# Altium project 定位.PrjPCB
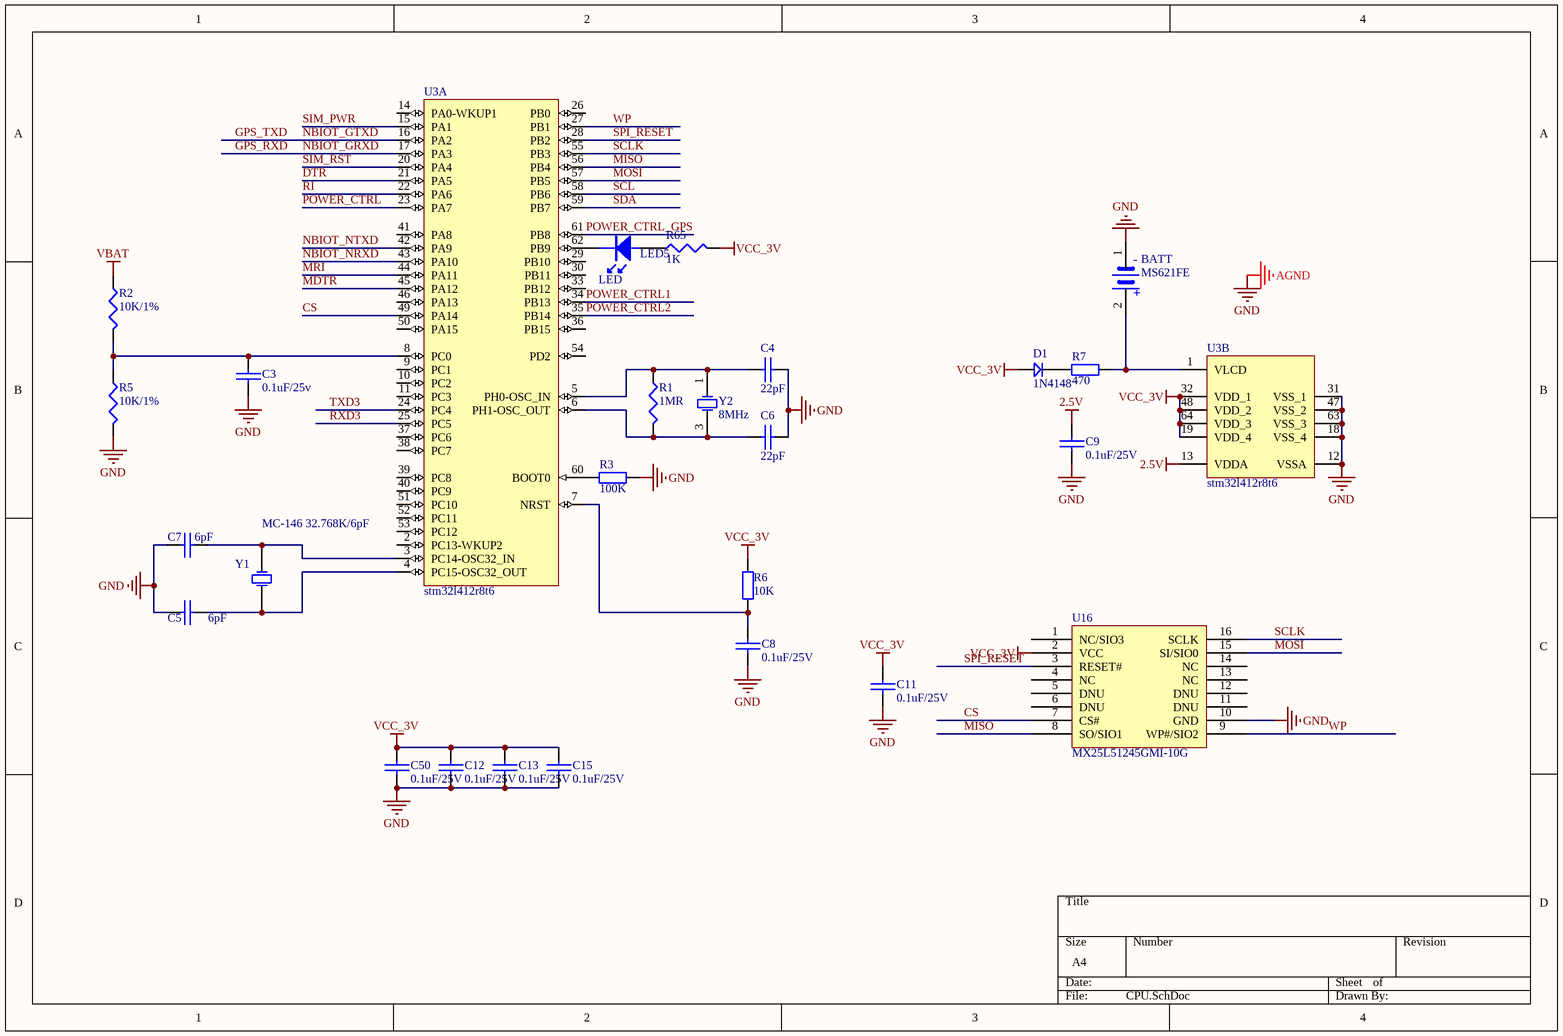
[diagram p0: CPU.SchDoc]
6 sheets, 164 parts. Net scope: global (net labels, ports and power ports of the same name join across sheets).
Board file: PCB1.PcbDoc
Sheets:
  CPU.SchDoc
  NBIOT.SchDoc
  4G.SchDoc
  sensors.SchDoc
  power.SchDoc
  GPS&&lte.SchDoc

## Sheet CPU.SchDoc
size A4

### Parts
BATT  MS621FE  [MS621FE]
C3  0.1uF/25v  [0402c]
C4  22pF  [0402c]
C5  6pF  [0402c]
C6  22pF  [0402c]
C7  6pF  [0402c]
C8  0.1uF/25V  [0402C]
C9  0.1uF/25V  [0402C]
C11  0.1uF/25V  [0402C]
C12  0.1uF/25V  [0402C]
C13  0.1uF/25V  [0402C]
C15  0.1uF/25V  [0402C]
C50  0.1uF/25V  [0402C]
D1  1N4148  [DIODE_SOP]
LED5  LED  [0603LED]
R1  1MR  [0402R]
R2  10K/1%  [0402R]
R3  100K  [0402R]
R5  10K/1%  [0402R]
R6  10K  [0402R]
R7  470  [0402R]
R65  1K  [0402R]
U3  stm32l412r8t6  [LQFP-64]  (parts A,B of 2)
U16  MX25L51245GMI-10G  [SOP127P1030X239-16N]
Y1  MC-146 32.768K/6pF  [32.768K]
Y2  8MHz  [OSCILLATOR-3.2X2.5]

### Nets
2.5V: C9.2 U3.13(VDDA)
AGND: BATT.1 C3.2 C4.1 C5.2 C6.1 C7.2 C8.1 C9.1 C11.1 C12.1 C13.1 C15.1 C50.1 R3.2 R5.2 U3.12(VSSA) U3.18(VSS_4) U3.31(VSS_1) U3.47(VSS_2) U3.63(VSS_3) U16.10(GND)  [also labelled GND]
VBAT: R2.1
VCC_3V: C11.2 C12.2 C13.2 C15.2 C50.2 D1.1 R6.1 R65.2 U3.19(VDD_4) U3.32(VDD_1) U3.48(VDD_2) U3.64(VDD_3) U16.2(VCC)  [project net VCC_3.3V_S]
CS: U3.49(PA14) U16.7(CS#)
DTR: U3.21(PA5)
GPS_RXD: U3.17(PA3)  [also labelled NBIOT_GRXD]
GPS_TXD: U3.16(PA2)  [also labelled NBIOT_GTXD]
MDTR: U3.45(PA12)
MISO: U3.56(PB4) U16.8(SO/SIO1)
MOSI: U3.57(PB5) U16.15(SI/SIO0)
MRI: U3.44(PA11)
NBIOT_NRXD: U3.43(PA10)
NBIOT_NTXD: U3.42(PA9)
POWER_CTRL: U3.23(PA7)
POWER_CTRL1: U3.34(PB13)
POWER_CTRL2: U3.35(PB14)
POWER_CTRL_GPS: U3.61(PB8)
RI: U3.22(PA6)
RXD3: U3.25(PC5)
SCL: U3.58(PB6)
SCLK: U3.55(PB3) U16.16(SCLK)
SDA: U3.59(PB7)
SIM_PWR: U3.15(PA1)
SIM_RST: U3.20(PA4)
SPI_RESET: U3.28(PB2) U16.3(RESET#)
TXD3: U3.24(PC4)
WP: U3.27(PB1) U16.9(WP#/SIO2)
NetBATT_2: BATT.2 R7.2 U3.1(VLCD)
NetC3_1: C3.1 R2.2 R5.1 U3.8(PC0)
NetC4_2: C4.2 R1.1 U3.5(PH0-OSC_IN) Y2.1(OSC1)
NetC5_1: C5.1 U3.4(PC15-OSC32_OUT) Y1.2(OSC2)
NetC6_2: C6.2 R1.2 U3.6(PH1-OSC_OUT) Y2.3(OSC2)
NetC7_1: C7.1 U3.3(PC14-OSC32_IN) Y1.1(OSC1)
NetC8_2: C8.2 R6.2 U3.7(NRST)
NetD1_2: D1.2 R7.1
NetLED5_1: LED5.1 R65.1
NetLED5_2: LED5.2 U3.62(PB9)
NetR3_1: R3.1 U3.60(BOOT0)

Not connected (* = marked no-connect by the designer): U3 2(PC13-WKUP2) 9(PC1) 10(PC2) 11(PC3) 14(PA0-WKUP1) 26(PB0) 29(PB10) 30(PB11) 33(PB12) 36(PB15) 37(PC6) 38(PC7) 39(PC8) 40(PC9) 41(PA8) 46(PA13) 50(PA15) 51(PC10) 52(PC11) 53(PC12) 54(PD2); U16 1(NC/SIO3) 4(NC) 5(DNU) 6(DNU) 11(DNU) 12(DNU) 13(NC) 14(NC)

### Notes on the sheet
- (in symbol SBatery) -; +

### Library data of the parts
BATT = SBatery
C3-C9 C11-C13 C15 C50 = CAP: Capacitor
D1 = D
R1 = Res3: Resistor; Published: 8-Jun-2000; LatestRevisionDate: 29-May-2009; LatestRevisionNote: IPC-7351 Footprint Added.; PackageReference: J1-0603; Publisher: Altium Limited; PackageDescription: Chip Resistor
R2 R5 R65 = RES1: P: 1/8W
R3 R6 R7 = Res2: Resistor; Value: 1K; Published: 8-Jun-2000; LatestRevisionDate: 17-Jul-2002; LatestRevisionNote: Re-released for DXP Platform.; PackageReference: AXIAL-0.4; Publisher: Altium Limited
U3 = STM32L100R8T6: ARM Cortex-M3 32-bit MCU, 64 KB Flash, 8 KB Internal RAM, 51 I/Os, 64-pin LQFP, -40 to 85 degC, Tray; Manufacturer: STMicroelectronics; D/A Converter: 2x12-bit (2 Channel); Data E2PROM nom (B): 2048; Display controller: LCD 4x32/8x28; FLASH Size (Prog) (kB): 64; I/Os (High Current): 51; Internal RAM Size (kB): 8; Operating Frequency(F) (Processor speed) (MHz): 32; Supply Voltage(Vcc) min (V): 1.8; DatasheetVersion: Rev. 1; PackageVersion: Rev. 4, 06/2013; PackageReference: LQFP64; PackageDescription: 64-Pin Low Profile Quad Flat Package, 10 x 10 mm Body, 0.5 mm Pitch; Core: ARM Cortex-M3; Packing: Tray; Mounting Technology: Surface Mount; PartNumber: STM32L100R8T6; ComponentLink1Description: Manufacturer URL; ComponentLink1URL: http://www.st.com/web/en/home.html; ComponentLink2Description: Datasheet; ComponentLink2URL: http://www.st.com/st-web-ui/static/active/en/resource/technical/document/datasheet/DM00078075.pdf; ComponentLink3Description: Package Specification; ComponentLink3URL: http://www.st.com/st-web-ui/static/active/en/resource/technical/document/datasheet/DM00037051.pdf
Y1 Y2 = XTAL: Crystal Oscillator; Published: 8-Jun-2000; LatestRevisionDate: 17-Jul-2002; LatestRevisionNote: Re-released for DXP Platform.; PackageReference: R38; Publisher: Altium Limited
  Y2: PackageDescription: Crystal, Thru-Hole; 2 Leads; Body 3.1 x 8.2 mm (Dia.xH)

## Sheet NBIOT.SchDoc
size A3
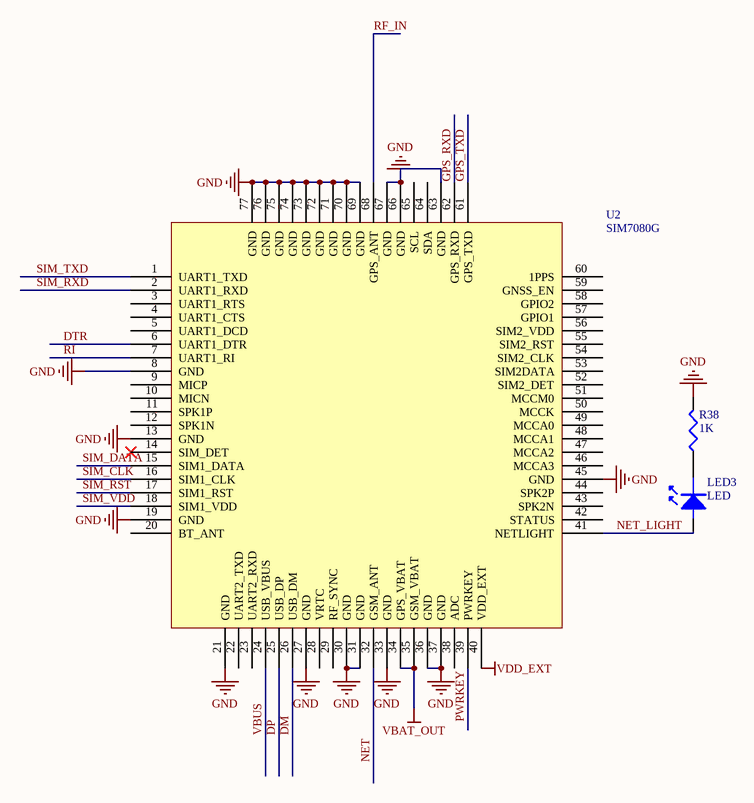
[diagram p1: NBIOT.SchDoc]

### Parts
LED3  LED  [0603LED]
R38  1K  [0402R]
U2  SIM7080G  [SIM868]

### Nets
GND: R38.2 U2.8(GND) U2.13(GND) U2.19(GND) U2.21(GND) U2.27(GND) U2.30(GND) U2.31(GND) U2.33(GND) U2.36(GND) U2.37(GND) U2.45(GND) U2.63(GND) U2.66(GND) U2.67(GND) U2.69(GND) U2.70(GND) U2.71(GND) U2.72(GND) U2.73(GND) U2.74(GND) U2.75(GND) U2.76(GND) U2.77(GND)  [project net AGND]
SIM_VDD: U2.18(SIM1_VDD)
VBAT_OUT: U2.34(GPS_VBAT) U2.35(GSM_VBAT)
VDD_EXT: U2.40(VDD_EXT)
DM: U2.26(USB_DM)
DP: U2.25(USB_DP)
DTR: U2.6(UART1_DTR)
GPS_RXD: U2.62(GPS_RXD)
GPS_TXD: U2.61(GPS_TXD)
NET: U2.32(GSM_ANT)
NET_LIGHT: LED3.1 U2.41(NETLIGHT)
PWRKEY: U2.39(PWRKEY)
RF_IN: U2.68(GPS_ANT)
RI: U2.7(UART1_RI)
SIM_CLK: U2.16(SIM1_CLK)
SIM_DATA: U2.15(SIM1_DATA)
SIM_RST: U2.17(SIM1_RST)
SIM_RXD: U2.2(UART1_RXD)
SIM_TXD: U2.1(UART1_TXD)
VBUS: U2.24(USB_VBUS)
NetLED3_2: LED3.2 R38.1

Not connected (* = marked no-connect by the designer): U2 3(UART1_RTS) 4(UART1_CTS) 5(UART1_DCD) 9(MICP) 10(MICN) 11(SPK1P) 12(SPK1N) 14(SIM_DET)* 20(BT_ANT) 22(UART2_TXD) 23(UART2_RXD) 28(VRTC) 29(RF_SYNC) 38(ADC) 42(STATUS) 43(SPK2N) 44(SPK2P) 46(MCCA3) 47(MCCA2) 48(MCCA1) 49(MCCA0) 50(MCCK) 51(MCCM0) 52(SIM2_DET) 53(SIM2DATA) 54(SIM2_CLK) 55(SIM2_RST) 56(SIM2_VDD) 57(GPIO1) 58(GPIO2) 59(GNSS_EN) 60(1PPS) 64(SDA) 65(SCL)

### Library data of the parts
R38 = RES1: P: 1/8W
U2 = SIM868E/SIM868

## Sheet 4G.SchDoc
size A2
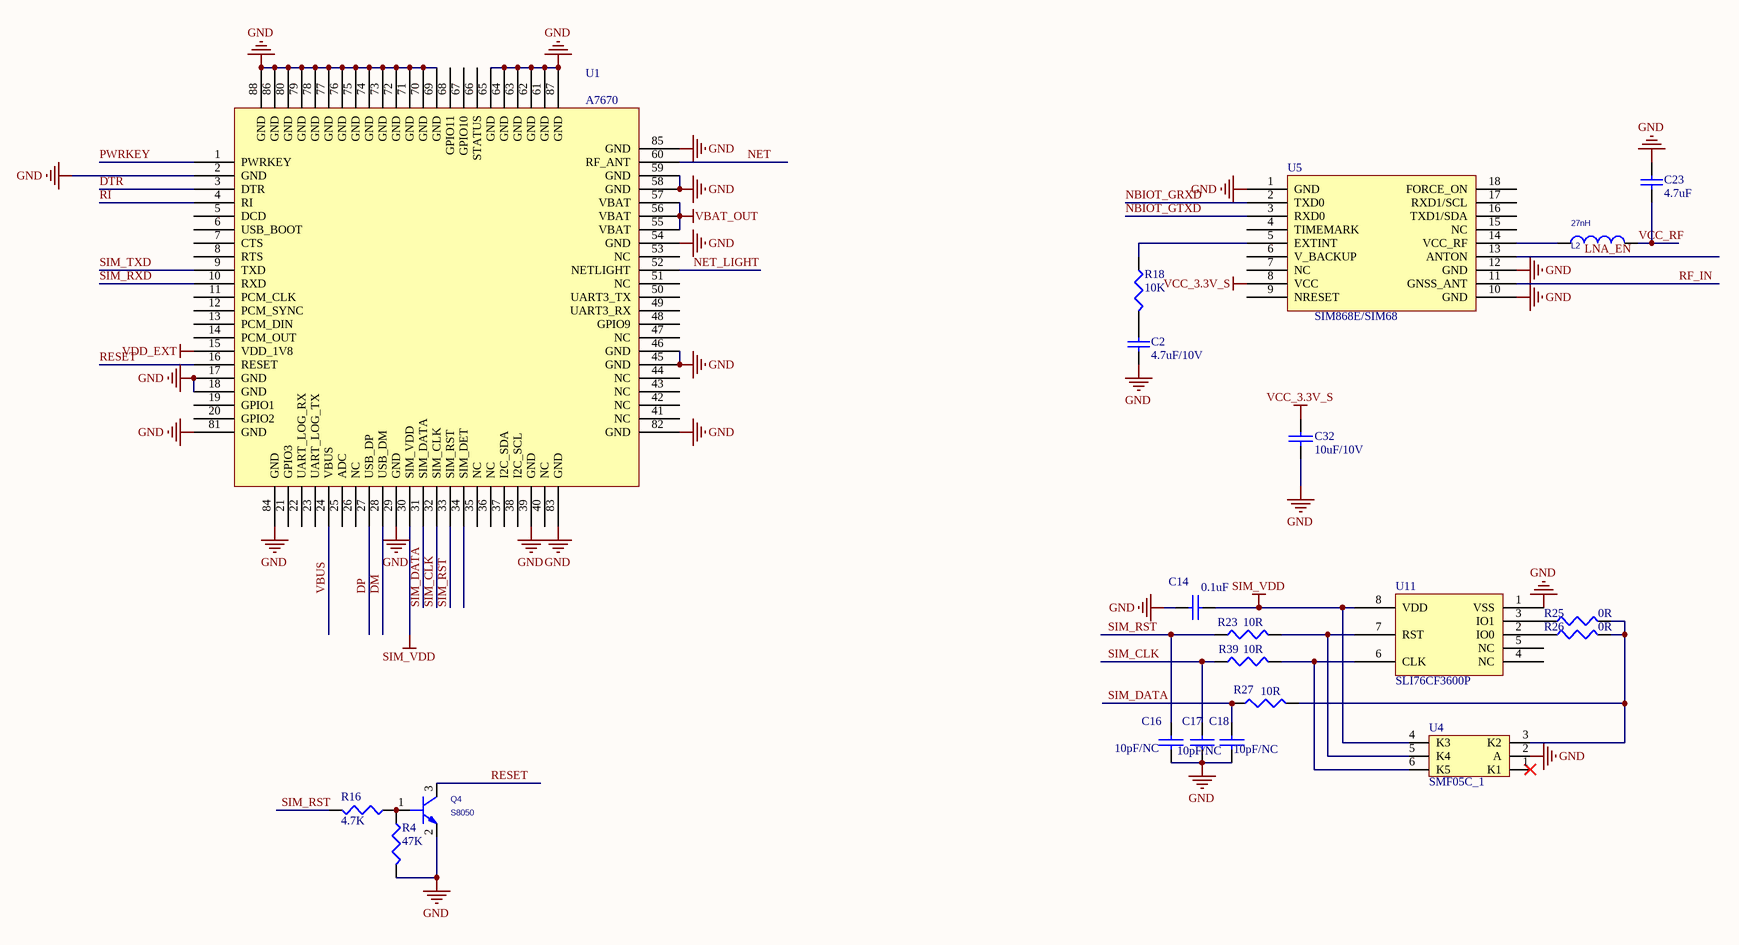
[diagram p2: 4G.SchDoc]

### Parts
C2  4.7uF/10V  [0402c]
C14  0.1uF  [0402C]
C16  10pF/NC  [0402C]
C17  10pF/NC  [0402C]
C18  10pF/NC  [0402C]
C23  4.7uF  [0402c]
C32  10uF/10V  [0402C]
L2  27nH  [0402R]
Q4  S8050  [SOT23]
R4  47K  [0402R]
R16  4.7K  [0402R]
R18  10K  [0402R]
R23  10R  [0402R]
R25  0R  [0402R]
R26  0R  [0402R]
R27  10R  [0402R]
R39  10R  [0402R]
U1  A7670  [A7670]
U4  SMF05C_1  [SC70-6L]
U5  SIM868E/SIM68  [SIM68MB]
U11  SLI76CF3600P  [QFN127P500X600X80-8N]

### Nets
GND: C2.1 C14.1 C16.1 C17.1 C18.1 C23.1 C32.1 Q4.2(E) R4.2 U1.2(GND) U1.17(GND) U1.18(GND) U1.29(GND) U1.39(GND) U1.45(GND) U1.46(GND) U1.54(GND) U1.58(GND) U1.59(GND) U1.61(GND) U1.62(GND) U1.63(GND) U1.64(GND) U1.65(GND) U1.69(GND) U1.70(GND) U1.71(GND) U1.72(GND) U1.73(GND) U1.74(GND) U1.75(GND) U1.76(GND) U1.77(GND) U1.78(GND) U1.79(GND) U1.80(GND) U1.81(GND) U1.82(GND) U1.83(GND) U1.84(GND) U1.85(GND) U1.86(GND) U1.87(GND) U1.88(GND) U4.2(A) U5.1(GND) U5.10(GND) U5.12(GND) U11.1(VSS)  [project net AGND]
SIM_VDD: C14.2 U1.30(SIM_VDD) U4.4(K3) U11.8(VDD)
VBAT_OUT: U1.55(VBAT) U1.56(VBAT) U1.57(VBAT)
VCC_3.3V_S: C32.2 U5.8(VCC)
VCC_RF: C23.2 L2.2
VDD_EXT: U1.15(VDD_1V8)
DM: U1.28(USB_DM)
DP: U1.27(USB_DP)
DTR: U1.3(DTR)
LNA_EN: U5.13(ANTON)
NBIOT_GRXD: U5.2(TXD0)  [project net GPS_RXD]
NBIOT_GTXD: U5.3(RXD0)  [project net GPS_TXD]
NET: U1.60(RF_ANT)
NET_LIGHT: U1.52(NETLIGHT)
PWRKEY: U1.1(PWRKEY)
RESET: Q4.3(C) U1.16(RESET)
RF_IN: U5.11(GNSS_ANT)
RI: U1.4(RI)
SIM_CLK: C17.2 R39.1 U1.32(SIM_CLK)
SIM_DATA: C18.2 R27.1 U1.31(SIM_DATA)
SIM_RST: C16.2 R16.2 R23.1 U1.33(SIM_RST)
SIM_RXD: U1.10(RXD)
SIM_TXD: U1.9(TXD)
VBUS: U1.24(VBUS)
NetC2_2: C2.2 R18.2
NetL2_1: L2.1 U5.14(VCC_RF)
NetQ4_1: Q4.1(B) R4.1 R16.1
NetR18_1: R18.1 U5.5(EXTINT)
NetR23_2: R23.2 U4.5(K4) U11.7(RST)
NetR25_1: R25.1 U11.3(IO1)
NetR25_2: R25.2 R26.2 R27.2 U4.3(K2)
NetR26_1: R26.1 U11.2(IO0)
NetR39_2: R39.2 U4.6(K5) U11.6(CLK)

Not connected (* = marked no-connect by the designer): U1 5(DCD) 6(USB_BOOT) 7(CTS) 8(RTS) 11(PCM_CLK) 12(PCM_SYNC) 13(PCM_DIN) 14(PCM_OUT) 19(GPIO1) 20(GPIO2) 21(GPIO3) 22(UART_LOG_RX) 23(UART_LOG_TX) 25(ADC) 26(NC) 34(SIM_DET) 35(NC) 36(NC) 37(I2C_SDA) 38(I2C_SCL) 40(NC) 41(NC) 42(NC) 43(NC) 44(NC) 47(NC) 48(GPIO9) 49(UART3_RX) 50(UART3_TX) 51(NC) 53(NC) 66(STATUS) 67(GPIO10) 68(GPIO11); U4 1(K1)*; U5 4(TIMEMARK) 6(V_BACKUP) 7(NC) 9(NRESET) 15(NC) 16(TXD1/SDA) 17(RXD1/SCL) 18(FORCE_ON); U11 4(NC) 5(NC)

### Library data of the parts
C2 C23 = Cap: Capacitor; Value: 0.1uF/10V; Published: 8-Jun-2000; LatestRevisionDate: 17-Jul-2002; LatestRevisionNote: Re-released for DXP Platform.; PackageReference: RAD-0.3; Publisher: Altium Limited
C14 C16-C18 C32 = CAP: Capacitor
L2 = INDUCTOR_1
Q4 = 2N1069_1: PspiceTemplate: Q^@REFDES %C %B %E
R4 R16 R18 R23 R25-R27 R39 = RES1: P: 1/8W
U4 = SMF05C_1: TVS
U5 = SIM68MB

## Sheet sensors.SchDoc
size A4
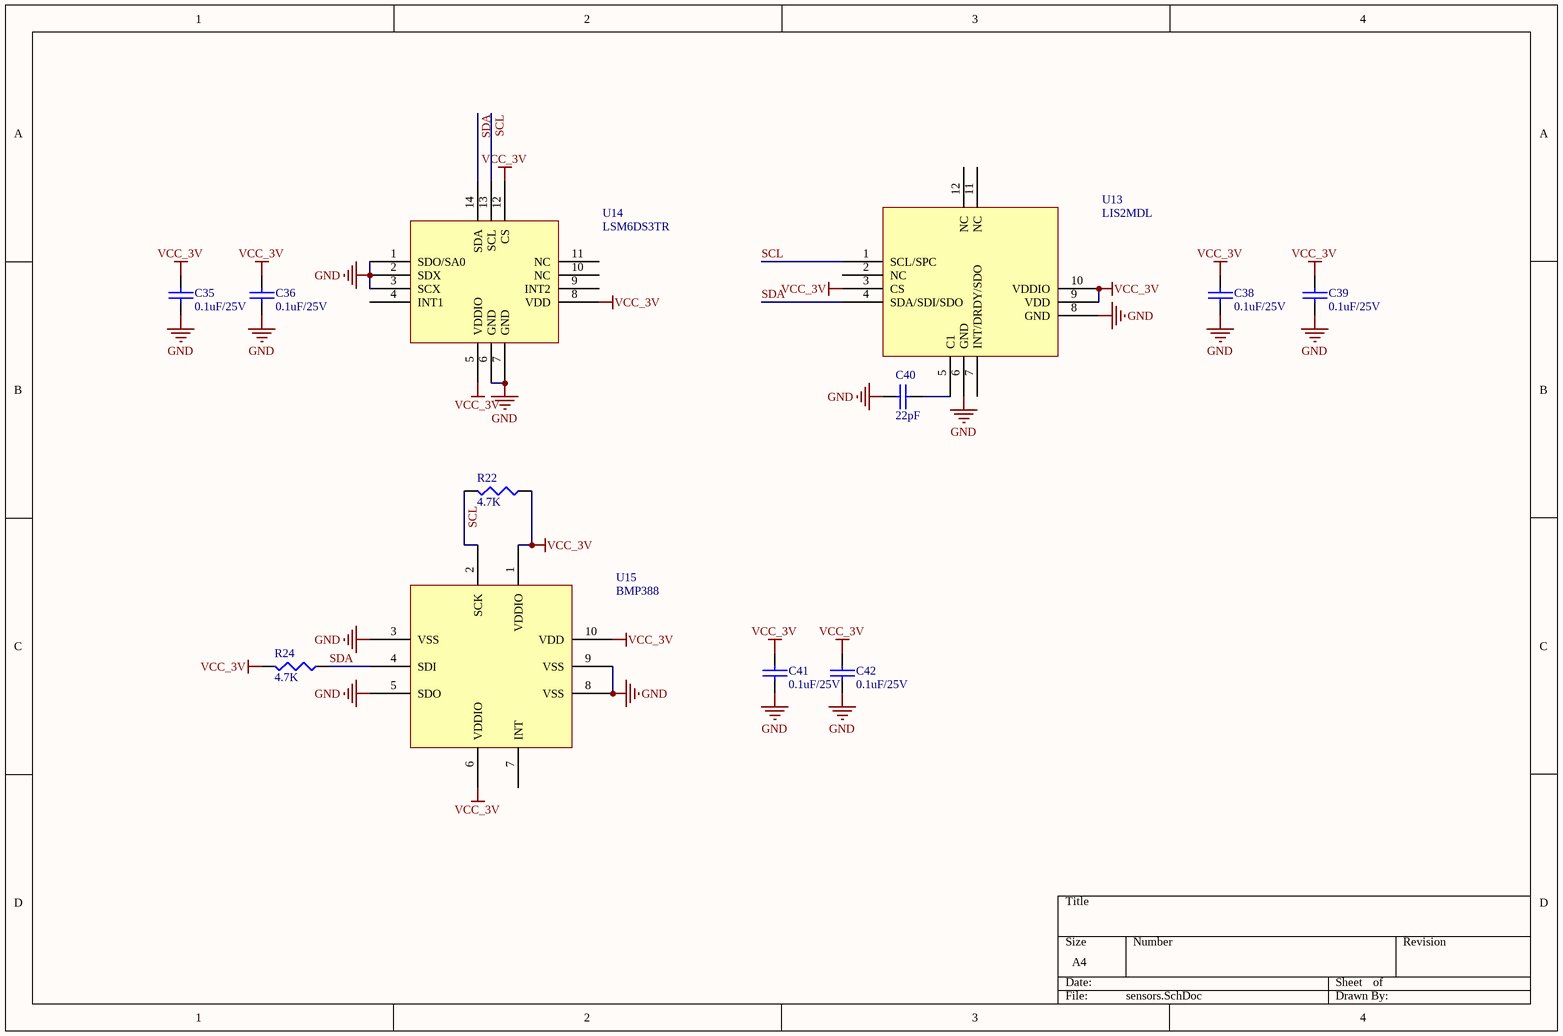
[diagram p3: sensors.SchDoc]

### Parts
C35  0.1uF/25V  [0402C]
C36  0.1uF/25V  [0402C]
C38  0.1uF/25V  [0402C]
C39  0.1uF/25V  [0402C]
C40  22pF  [0402c]
C41  0.1uF/25V  [0402C]
C42  0.1uF/25V  [0402C]
R22  4.7K  [0402R]
R24  4.7K  [0402R]
U13  LIS2MDL  [LIS2MDL]
U14  LSM6DS3TR  [LSM6DS3TR-C]
U15  BMP388  [BMP388]

### Nets
GND: C35.1 C36.1 C38.1 C39.1 C40.2 C41.1 C42.1 U13.6(GND) U13.8(GND) U14.1(SDO/SA0) U14.2(SDX) U14.3(SCX) U14.6(GND) U14.7(GND) U15.3(VSS) U15.5(SDO) U15.8(VSS) U15.9(VSS)  [project net AGND]
VCC_3V: C35.2 C36.2 C38.2 C39.2 C41.2 C42.2 R22.1 R24.2 U13.3(CS) U13.9(VDD) U13.10(VDDIO) U14.5(VDDIO) U14.8(VDD) U14.12(CS) U15.1(VDDIO) U15.6(VDDIO) U15.10(VDD)  [project net VCC_3.3V_S]
SCL: R22.2 U13.1(SCL/SPC) U14.13(SCL) U15.2(SCK)
SDA: R24.1 U13.4(SDA/SDI/SDO) U14.14(SDA) U15.4(SDI)
NetC40_1: C40.1 U13.5(C1)

Not connected (* = marked no-connect by the designer): U13 2(NC) 7(INT/DRDY/SDO) 11(NC) 12(NC); U14 4(INT1) 9(INT2) 10(NC) 11(NC); U15 7(INT)

### Library data of the parts
C35 C36 C38-C42 = CAP: Capacitor
R22 R24 = RES1: P: 1/8W

## Sheet power.SchDoc
size A3
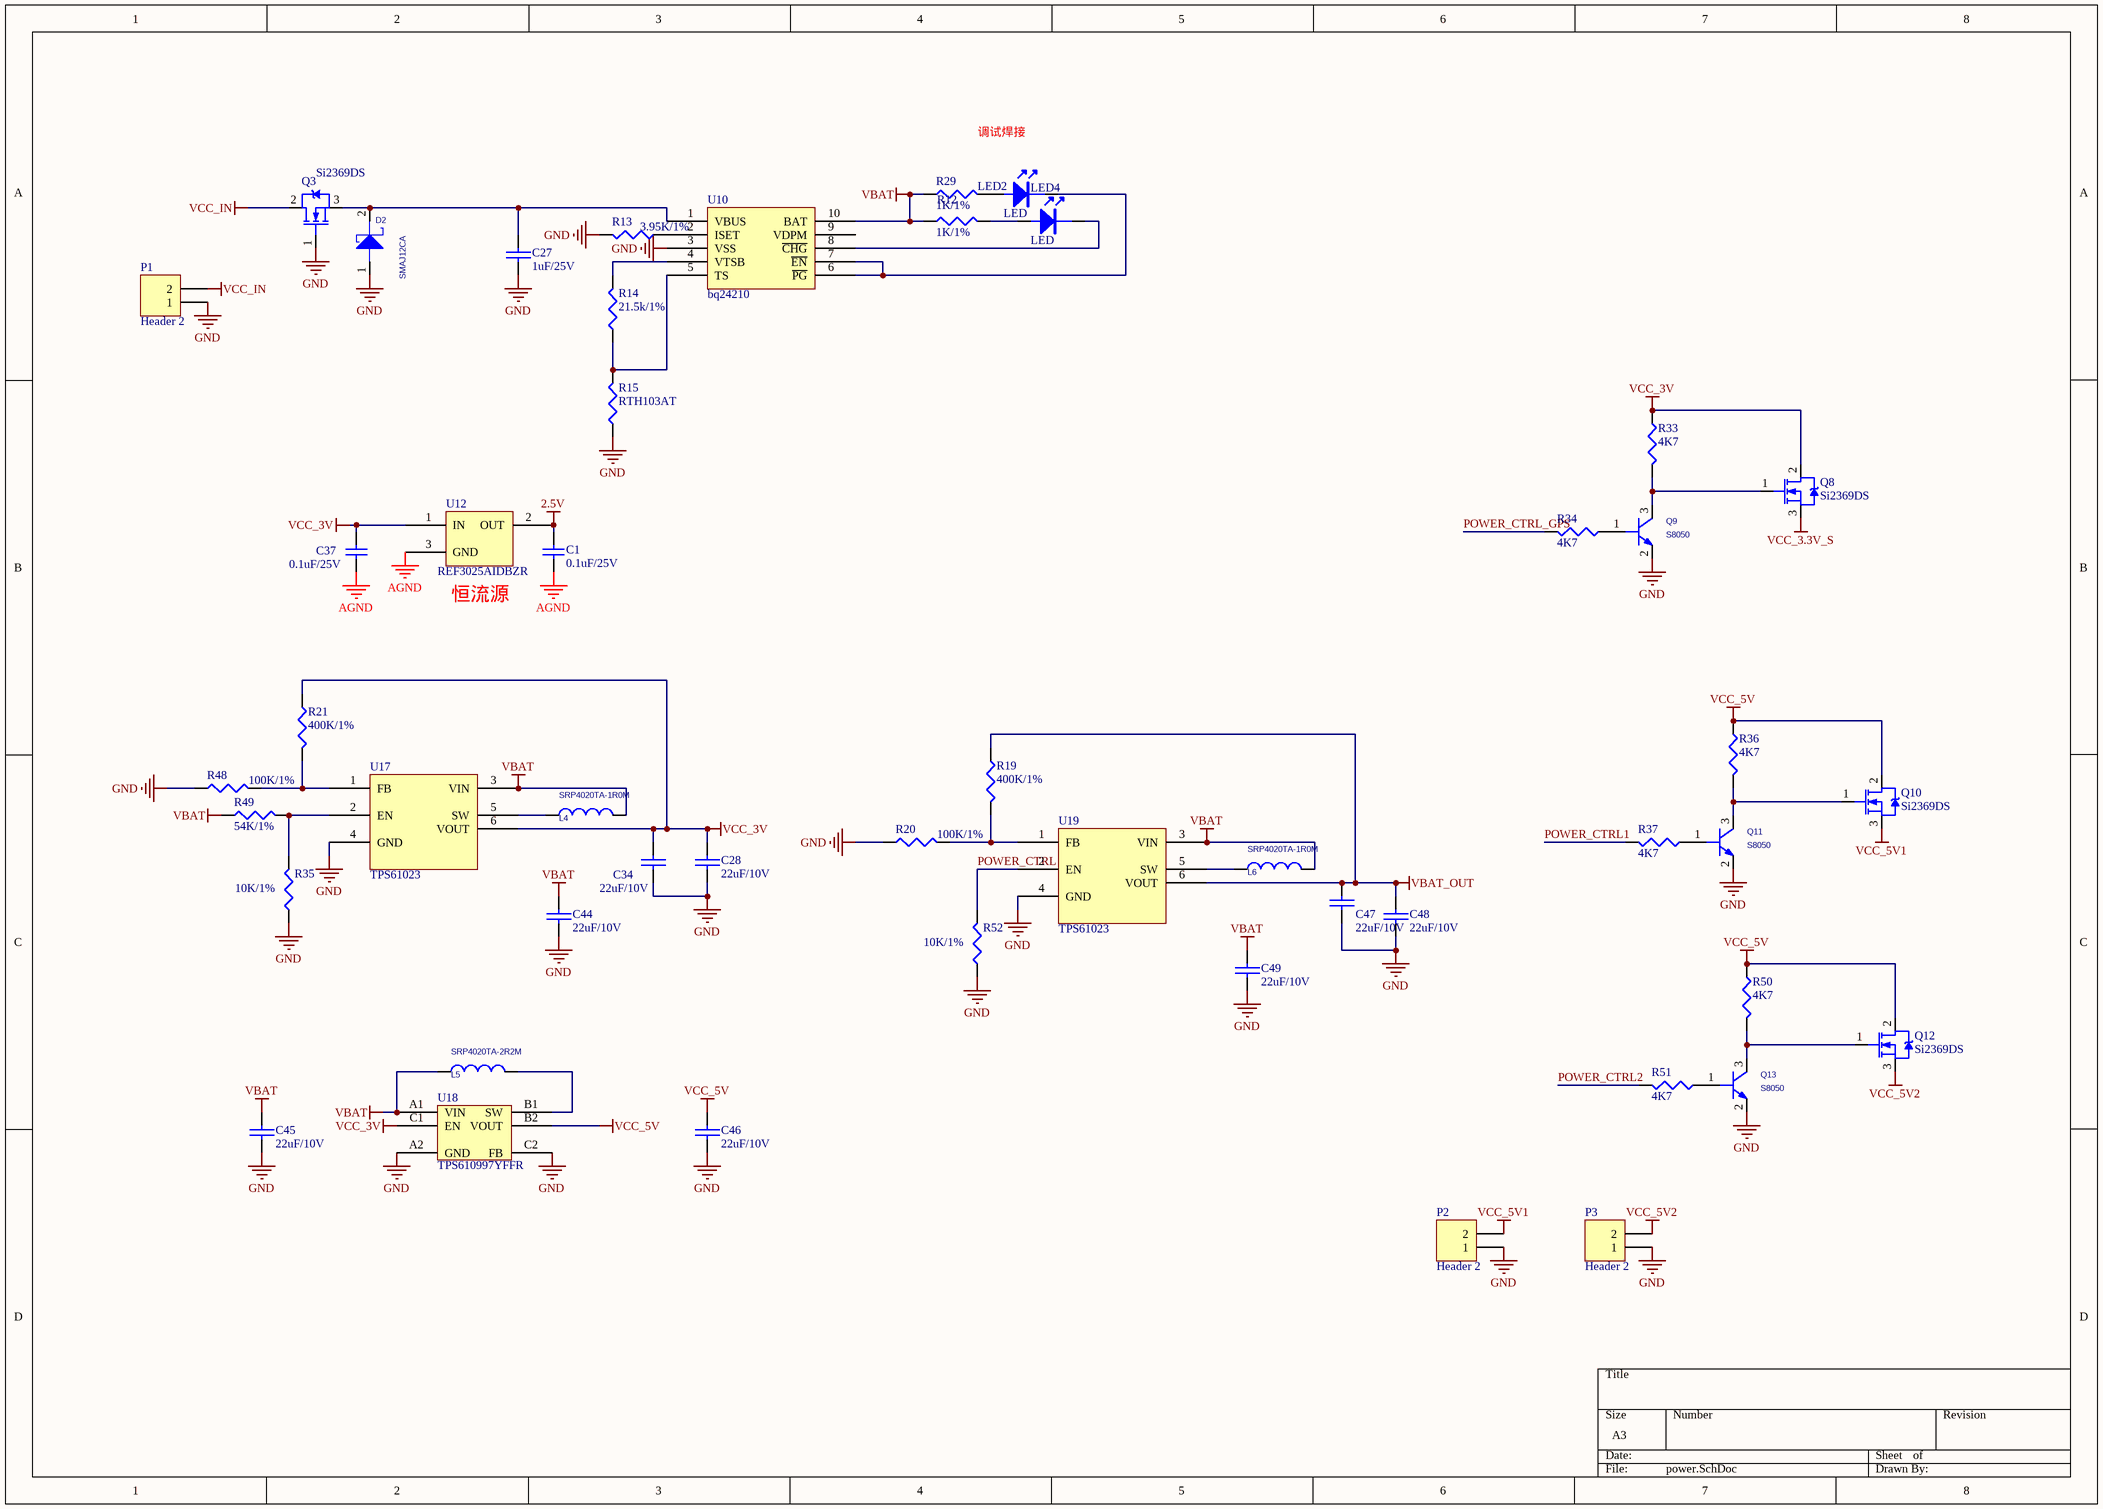
[diagram p4: power.SchDoc]

### Parts
C1  0.1uF/25V  [0402c]
C27  1uF/25V  [0402C]
C28  22uF/10V  [0805C]
C34  22uF/10V  [0805C]
C37  0.1uF/25V  [0402c]
C44  22uF/10V  [0805C]
C45  22uF/10V  [0805C]
C46  22uF/10V  [0805C]
C47  22uF/10V  [0805C]
C48  22uF/10V  [0805C]
C49  22uF/10V  [0805C]
D2  SMAJ12CA  [SMA]
L4  SRP4020TA-1R0M  [CD_4*4]
L5  SRP4020TA-2R2M  [CD_4*4]
L6  SRP4020TA-1R0M  [CD_4*4]
LED2  LED  [0603LED]
LED4  LED  [0603LED]
P1  Header 2  [HDR1X2]
P2  Header 2  [HDR1X2]
P3  Header 2  [HDR1X2]
Q3  Si2369DS  [sot23-3]
Q8  Si2369DS  [sot23-3]
Q9  S8050  [SOT23-3]
Q10  Si2369DS  [sot23-3]
Q11  S8050  [SOT23-3]
Q12  Si2369DS  [sot23-3]
Q13  S8050  [SOT23-3]
R12  1K/1%  [0402R]
R13  3.95K/1%  [0402R]
R14  21.5k/1%  [0402R]
R15  RTH103AT  [0603R]
R19  400K/1%  [0402R]
R20  100K/1%  [0402R]
R21  400K/1%  [0402R]
R29  1K/1%  [0402R]
R33  4K7  [0402R]
R34  4K7  [0402R]
R35  10K/1%  [0402R]
R36  4K7  [0402R]
R37  4K7  [0402R]
R48  100K/1%  [0402R]
R49  54K/1%  [0402R]
R50  4K7  [0402R]
R51  4K7  [0402R]
R52  10K/1%  [0402R]
U10  bq24210  [QFN50P200X300X80-10N]
U12  REF3025AIDBZR  [SOT23-3]
U17  TPS61023
U18  TPS610997YFFR  [TPS610997YFFR]
U19  TPS61023

### Nets
2.5V: C1.1 U12.2(OUT)
AGND: C1.2 C27.2 C28.2 C34.2 C37.2 C44.2 C45.2 C46.2 C47.2 C48.2 C49.2 D2.1 P1.1 P2.1 P3.1 Q3.1(G) Q9.2(E) Q11.2(E) Q13.2(E) R13.2 R15.1 R20.1 R35.1 R48.1 R52.1 U10.3(VSS) U12.3(GND) U17.4(GND) U18.A2(GND) U18.C2(FB) U19.4(GND)  [also labelled GND]
VBAT: C44.1 C45.1 C49.1 L4.2 L5.1 L6.2 R12.1 R29.1 R49.1 U10.10(BAT) U17.3(VIN) U18.A1(VIN) U19.3(VIN)
VBAT_OUT: C47.1 C48.1 R19.1 U19.6(VOUT)
VCC_3.3V_S: C28.1 C34.1 C37.1 Q8.2(D) Q8.3(S) R21.1 R33.1 U12.1(IN) U17.6(VOUT) U18.C1(EN)  [also labelled VCC_3V]
VCC_5V: C46.1 Q10.2(D) Q12.2(D) R36.1 R50.1 U18.B2(VOUT)
VCC_5V1: P2.2 Q10.3(S)
VCC_5V2: P3.2 Q12.3(S)
VCC_IN: P1.2 Q3.2(D)
POWER_CTRL: R52.2 U19.2(EN)
POWER_CTRL1: R37.2
POWER_CTRL2: R51.2
POWER_CTRL_GPS: R34.2
NetC27_1: C27.1 D2.2 Q3.3(S) U10.1(VBUS)
NetL4_1: L4.1 U17.5(SW)
NetL5_2: L5.2 U18.B1(SW)
NetL6_1: L6.1 U19.5(SW)
NetLED2_1: LED2.1 R29.2
NetLED2_2: LED2.2 U10.6(~{PG}) U10.7(~{EN})
NetLED4_1: LED4.1 R12.2
NetLED4_2: LED4.2 U10.8(~{CHG})
NetQ8_1: Q8.1(G) Q9.3(C) R33.2
NetQ9_1: Q9.1(B) R34.1
NetQ10_1: Q10.1(G) Q11.3(C) R36.2
NetQ11_1: Q11.1(B) R37.1
NetQ12_1: Q12.1(G) Q13.3(C) R50.2
NetQ13_1: Q13.1(B) R51.1
NetR13_1: R13.1 U10.2(ISET)
NetR14_1: R14.1 R15.2 U10.5(TS)
NetR14_2: R14.2 U10.4(VTSB)
NetR19_2: R19.2 R20.2 U19.1(FB)
NetR21_2: R21.2 R48.2 U17.1(FB)
NetR35_2: R35.2 R49.2 U17.2(EN)

Not connected (* = marked no-connect by the designer): U10 9(VDPM)

### Notes on the sheet
- 调试焊接
- (near U12) 恒流源

### Library data of the parts
C1 C37 = Cap: Capacitor; Value: 0.1uF; Published: 8-Jun-2000; LatestRevisionDate: 17-Jul-2002; LatestRevisionNote: Re-released for DXP Platform.; PackageReference: RAD-0.3; Publisher: Altium Limited; PackageDescription: Radial Cap, Thru-Hole; 2 Leads; 0.3 in Pin Spacing
C27 C28 C34 C44-C49 = CAP: Capacitor
D2 = DIODE_SCHOTTKY_0: PCB DECAL: DO_214AC; Source_Path: E:\AIH\WORK\A\LIBRARY1.OLB; Value: SMAJ12CA
L4-L6 = INDUCTOR_1
P1-P3 = Header 2: Header, 2-Pin; LatestRevisionDate: 17-Jul-2002; LatestRevisionNote: Re-released for DXP Platform.; Publisher: Altium Limited
Q3 Q8 Q10 Q12 = NCE4060K: NMOSFET
Q9 Q11 Q13 = 2N1069_1: PspiceTemplate: Q^@REFDES %C %B %E
R12-R15 R19-R21 R29 R33-R37 R48-R52 = RES1: P: 1/8W
U10 = bq2410
U12 = REF3012

## Sheet GPS&&lte.SchDoc
size A2
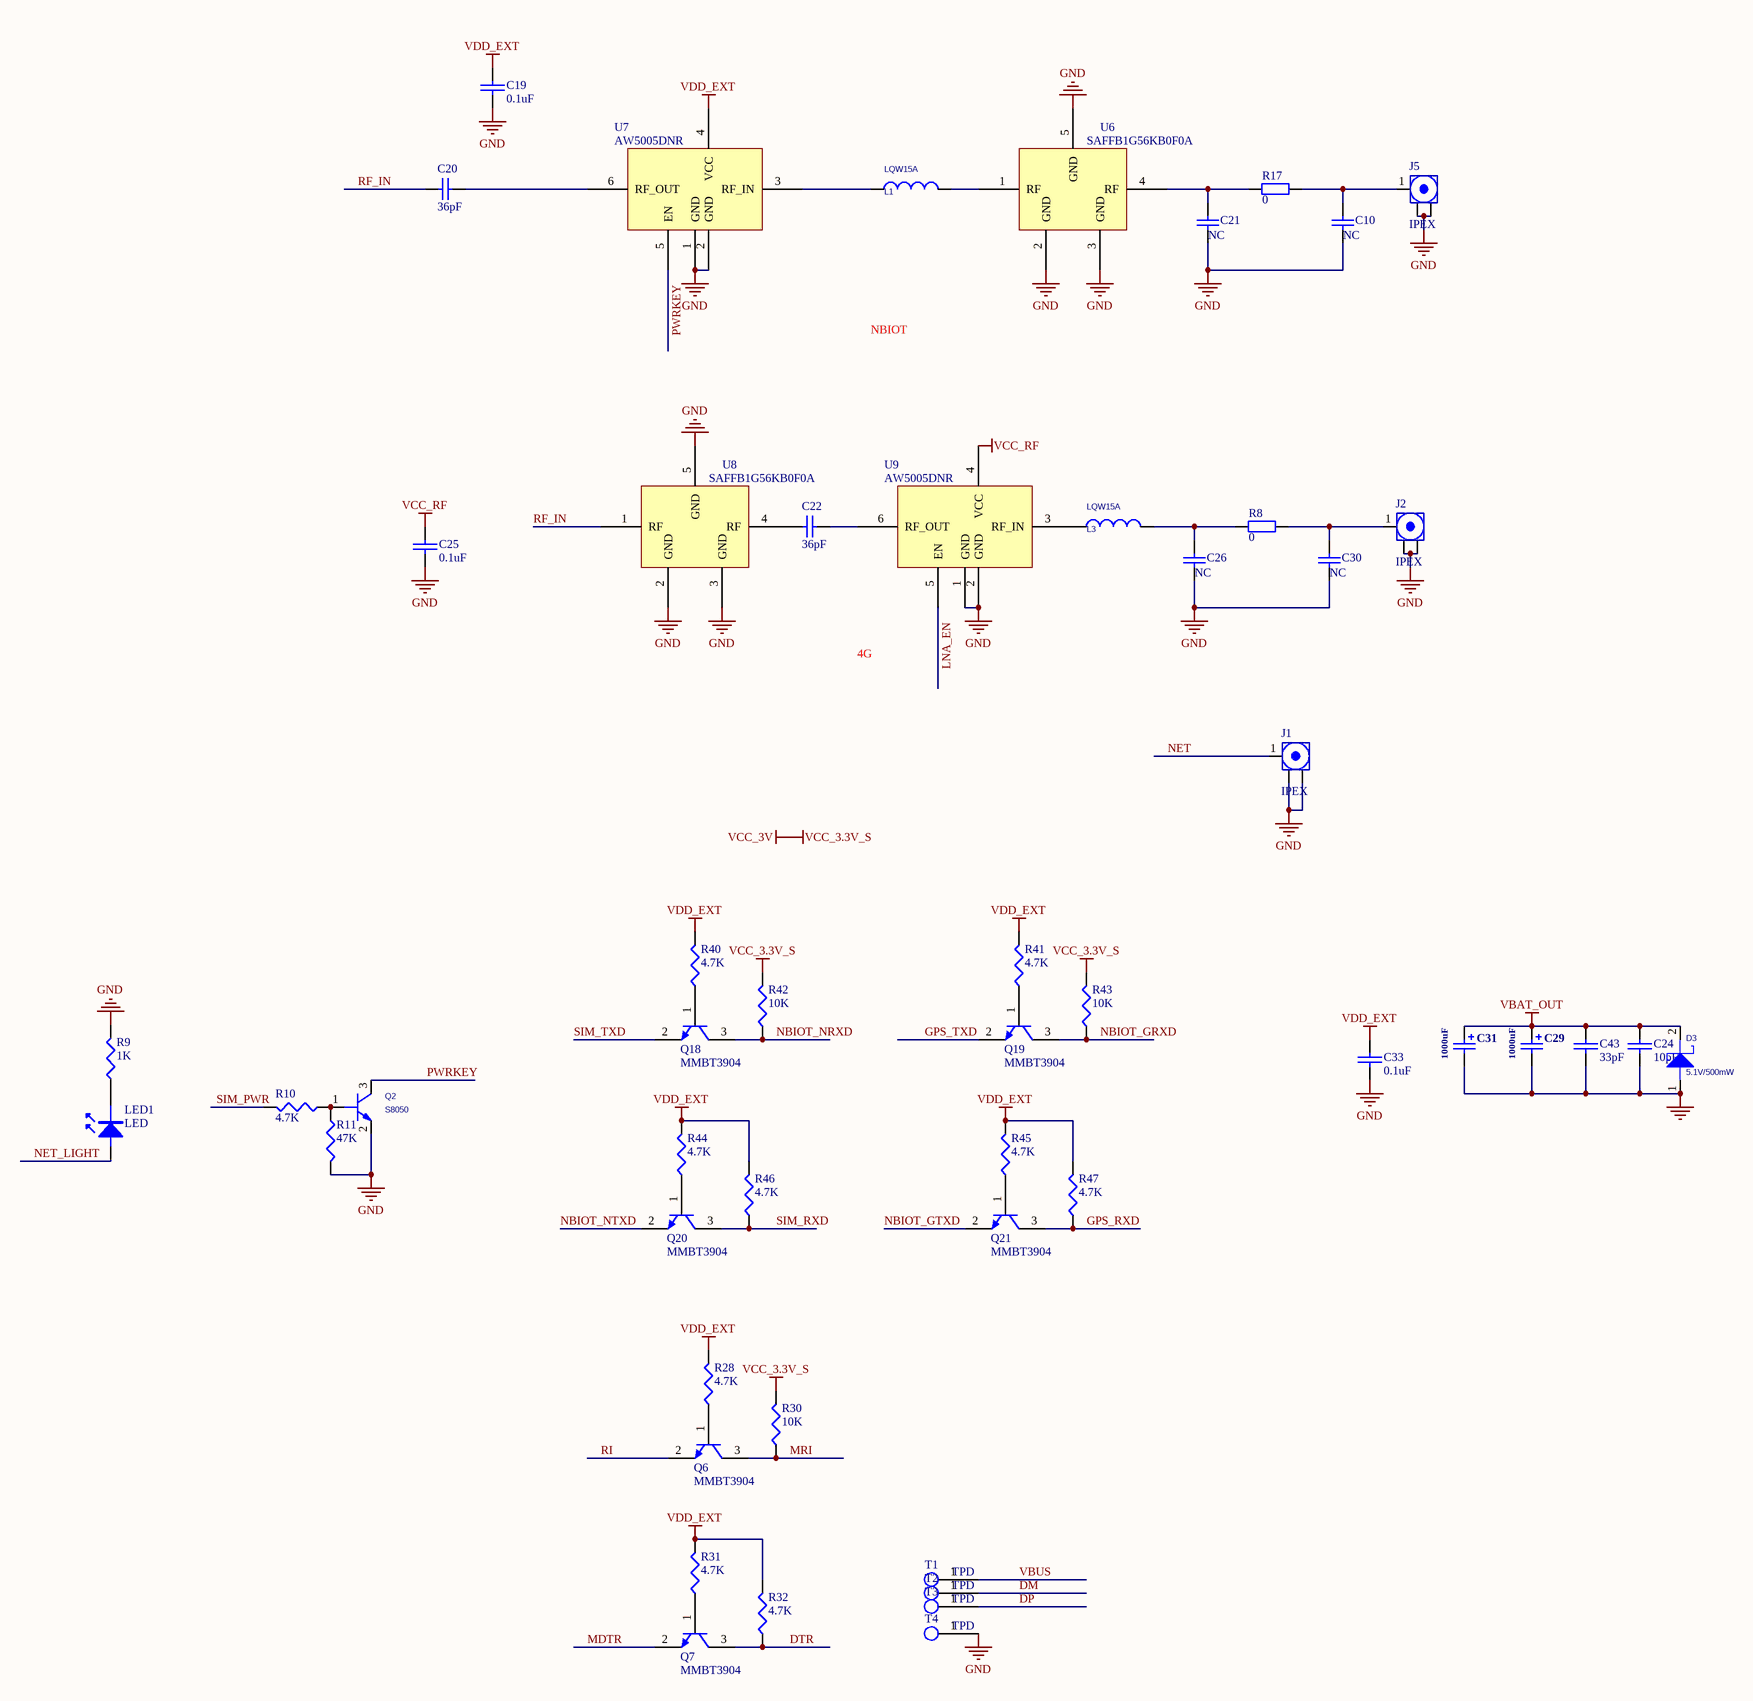
[diagram p5: GPS&&lte.SchDoc]

### Parts
C10  NC  [0402c]
C19  0.1uF  [0402C]
C20  36pF  [0402c]
C21  NC  [0402c]
C22  36pF  [0402c]
C24  10pF  [0402C]
C25  0.1uF  [0402C]
C26  NC  [0402c]
C29  1000uF  [7343]
C30  NC  [0402c]
C31  1000uF  [7343]
C33  0.1uF  [0402C]
C43  33pF  [0402C]
D3  value 5.1V/500mW  [LL-34(D1206)]  (hidden comment: DIODE_SCHOTTKY_0)
J1  IPEX  [RF-UFL]
J2  IPEX  [RF-UFL]
J5  IPEX  [RF-UFL]
L1  LQW15A  [0402R]
L3  LQW15A  [0402R]
LED1  LED  [0603LED]
Q2  S8050  [SOT23]
Q6  MMBT3904  [SOT23-3]
Q7  MMBT3904  [SOT23-3]
Q18  MMBT3904  [SOT23-3]
Q19  MMBT3904  [SOT23-3]
Q20  MMBT3904  [SOT23-3]
Q21  MMBT3904  [SOT23-3]
R8  0  [0402R]
R9  1K  [0402R]
R10  4.7K  [0402R]
R11  47K  [0402R]
R17  0  [0402R]
R28  4.7K  [0402R]
R30  10K  [0402R]
R31  4.7K  [0402R]
R32  4.7K  [0402R]
R40  4.7K  [0402R]
R41  4.7K  [0402R]
R42  10K  [0402R]
R43  10K  [0402R]
R44  4.7K  [0402R]
R45  4.7K  [0402R]
R46  4.7K  [0402R]
R47  4.7K  [0402R]
T1  TPD  [TPD]
T2  TPD  [TPD]
T3  TPD  [TPD]
T4  TPD  [TPD]
U6  SAFFB1G56KB0F0A  [SAFFB1G56KB0F0A]
U7  AW5005DNR  [AW5005]
U8  SAFFB1G56KB0F0A  [SAFFB1G56KB0F0A]
U9  AW5005DNR  [AW5005]

### Nets
GND: C10.2 C19.1 C21.2 C24.1 C25.1 C26.2 C29.2 C30.2 C31.2 C33.1 C43.1 D3.1 J1.2(Y) J2.2(Y) J5.2(Y) Q2.2(E) R9.2 R11.2 T4.1 U6.2(GND) U6.3(GND) U6.5(GND) U7.1(GND) U7.2(GND) U8.2(GND) U8.3(GND) U8.5(GND) U9.1(GND) U9.2(GND)  [project net AGND]
VBAT_OUT: C24.2 C29.1 C31.1 C43.2 D3.2
VCC_3.3V_S: R30.2 R42.2 R43.2  [also labelled VCC_3V]
VCC_RF: C25.2 U9.4(VCC)
VDD_EXT: C19.2 C33.2 R28.2 R31.2 R32.2 R40.2 R41.2 R44.2 R45.2 R46.2 R47.2 U7.4(VCC)
DM: T2.1
DP: T3.1
DTR: Q7.3(C) R32.1
GPS_RXD: Q19.3(C) Q21.3(C) R43.1 R47.1  [also labelled NBIOT_GRXD]
GPS_TXD: Q19.2(E) Q21.2(E)  [also labelled NBIOT_GTXD]
LNA_EN: U9.5(EN)
MDTR: Q7.2(E)
MRI: Q6.3(C) R30.1
NBIOT_NRXD: Q18.3(C) R42.1
NBIOT_NTXD: Q20.2(E)
NET: J1.1(X)
NET_LIGHT: LED1.1
PWRKEY: Q2.3(C) U7.5(EN)
RF_IN: C20.1 U8.1(RF)
RI: Q6.2(E)
SIM_PWR: R10.2
SIM_RXD: Q20.3(C) R46.1
SIM_TXD: Q18.2(E)
VBUS: T1.1
NetC10_1: C10.1 J5.1(X) R17.2
NetC20_2: C20.2 U7.6(RF_OUT)
NetC21_1: C21.1 R17.1 U6.4(RF)
NetC22_1: C22.1 U8.4(RF)
NetC22_2: C22.2 U9.6(RF_OUT)
NetC26_1: C26.1 L3.2 R8.1
NetC30_1: C30.1 J2.1(X) R8.2
NetL1_1: L1.1 U7.3(RF_IN)
NetL1_2: L1.2 U6.1(RF)
NetL3_1: L3.1 U9.3(RF_IN)
NetLED1_2: LED1.2 R9.1
NetQ2_1: Q2.1(B) R10.1 R11.1
NetQ6_1: Q6.1(B) R28.1
NetQ7_1: Q7.1(B) R31.1
NetQ18_1: Q18.1(B) R40.1
NetQ19_1: Q19.1(B) R41.1
NetQ20_1: Q20.1(B) R44.1
NetQ21_1: Q21.1(B) R45.1

### Notes on the sheet
- NBIOT
- 4G

### Library data of the parts
C10 C20-C22 C26 C30 = Cap: Capacitor; Value: 0.1uF/10V; Published: 8-Jun-2000; LatestRevisionDate: 17-Jul-2002; LatestRevisionNote: Re-released for DXP Platform.; PackageReference: RAD-0.3; Publisher: Altium Limited
C19 C24 C25 C33 C43 = CAP: Capacitor
C29 C31 = Cap Pol3: Polarized Capacitor (Surface Mount); PackageReference: C10*10.2
D3 = DIODE_SCHOTTKY_0: as D2 on sheet power
J1 J2 J5 = ANT
L1 L3 = INDUCTOR_1
Q2 = 2N1069_1: PspiceTemplate: Q^@REFDES %C %B %E
Q6 Q7 Q18-Q21 = NPN
R8 R17 = Res2: Resistor; Published: 8-Jun-2000; LatestRevisionDate: 17-Jul-2002; LatestRevisionNote: Re-released for DXP Platform.; PackageReference: AXIAL-0.4; Publisher: Altium Limited; Value: 0
R9-R11 R28 R30-R32 R40-R47 = RES1: P: 1/8W
U6 U8 = SAFFB1G56KBOFA

## Nets that join several sheets
2.5V: CPU (C9.2 U3.13), power (C1.1 U12.2)
AGND: CPU (21 pins), NBIOT (24 pins), 4G (49 pins), sensors (18 pins), power (31 pins), GPS&&lte (29 pins)
SIM_VDD: NBIOT (U2.18), 4G (C14.2 U1.30 U4.4 U11.8)
VBAT: CPU (R2.1), power (13 pins)
VBAT_OUT: NBIOT (U2.34 U2.35), 4G (U1.55 U1.56 U1.57), power (C47.1 C48.1 R19.1 U19.6), GPS&&lte (5 pins)
VCC_3.3V_S: CPU (13 pins), 4G (C32.2 U5.8), sensors (17 pins), power (10 pins), GPS&&lte (R30.2 R42.2 R43.2)
VCC_RF: 4G (C23.2 L2.2), GPS&&lte (C25.2 U9.4)
VDD_EXT: NBIOT (U2.40), 4G (U1.15), GPS&&lte (12 pins)
DM: NBIOT (U2.26), 4G (U1.28), GPS&&lte (T2.1)
DP: NBIOT (U2.25), 4G (U1.27), GPS&&lte (T3.1)
DTR: CPU (U3.21), NBIOT (U2.6), 4G (U1.3), GPS&&lte (Q7.3 R32.1)
GPS_RXD: CPU (U3.17), NBIOT (U2.62), 4G (U5.2), GPS&&lte (Q19.3 Q21.3 R43.1 R47.1)
GPS_TXD: CPU (U3.16), NBIOT (U2.61), 4G (U5.3), GPS&&lte (Q19.2 Q21.2)
LNA_EN: 4G (U5.13), GPS&&lte (U9.5)
MDTR: CPU (U3.45), GPS&&lte (Q7.2)
MRI: CPU (U3.44), GPS&&lte (Q6.3 R30.1)
NBIOT_NRXD: CPU (U3.43), GPS&&lte (Q18.3 R42.1)
NBIOT_NTXD: CPU (U3.42), GPS&&lte (Q20.2)
NET: NBIOT (U2.32), 4G (U1.60), GPS&&lte (J1.1)
NET_LIGHT: NBIOT (LED3.1 U2.41), 4G (U1.52), GPS&&lte (LED1.1)
POWER_CTRL: CPU (U3.23), power (R52.2 U19.2)
POWER_CTRL1: CPU (U3.34), power (R37.2)
POWER_CTRL2: CPU (U3.35), power (R51.2)
POWER_CTRL_GPS: CPU (U3.61), power (R34.2)
PWRKEY: NBIOT (U2.39), 4G (U1.1), GPS&&lte (Q2.3 U7.5)
RF_IN: NBIOT (U2.68), 4G (U5.11), GPS&&lte (C20.1 U8.1)
RI: CPU (U3.22), NBIOT (U2.7), 4G (U1.4), GPS&&lte (Q6.2)
SCL: CPU (U3.58), sensors (R22.2 U13.1 U14.13 U15.2)
SDA: CPU (U3.59), sensors (R24.1 U13.4 U14.14 U15.4)
SIM_CLK: NBIOT (U2.16), 4G (C17.2 R39.1 U1.32)
SIM_DATA: NBIOT (U2.15), 4G (C18.2 R27.1 U1.31)
SIM_PWR: CPU (U3.15), GPS&&lte (R10.2)
SIM_RST: CPU (U3.20), NBIOT (U2.17), 4G (C16.2 R16.2 R23.1 U1.33)
SIM_RXD: NBIOT (U2.2), 4G (U1.10), GPS&&lte (Q20.3 R46.1)
SIM_TXD: NBIOT (U2.1), 4G (U1.9), GPS&&lte (Q18.2)
VBUS: NBIOT (U2.24), 4G (U1.24), GPS&&lte (T1.1)